# Altium schematic sheet Elreg_Sender_Power.SchDoc
size A; SheetNumber: 3
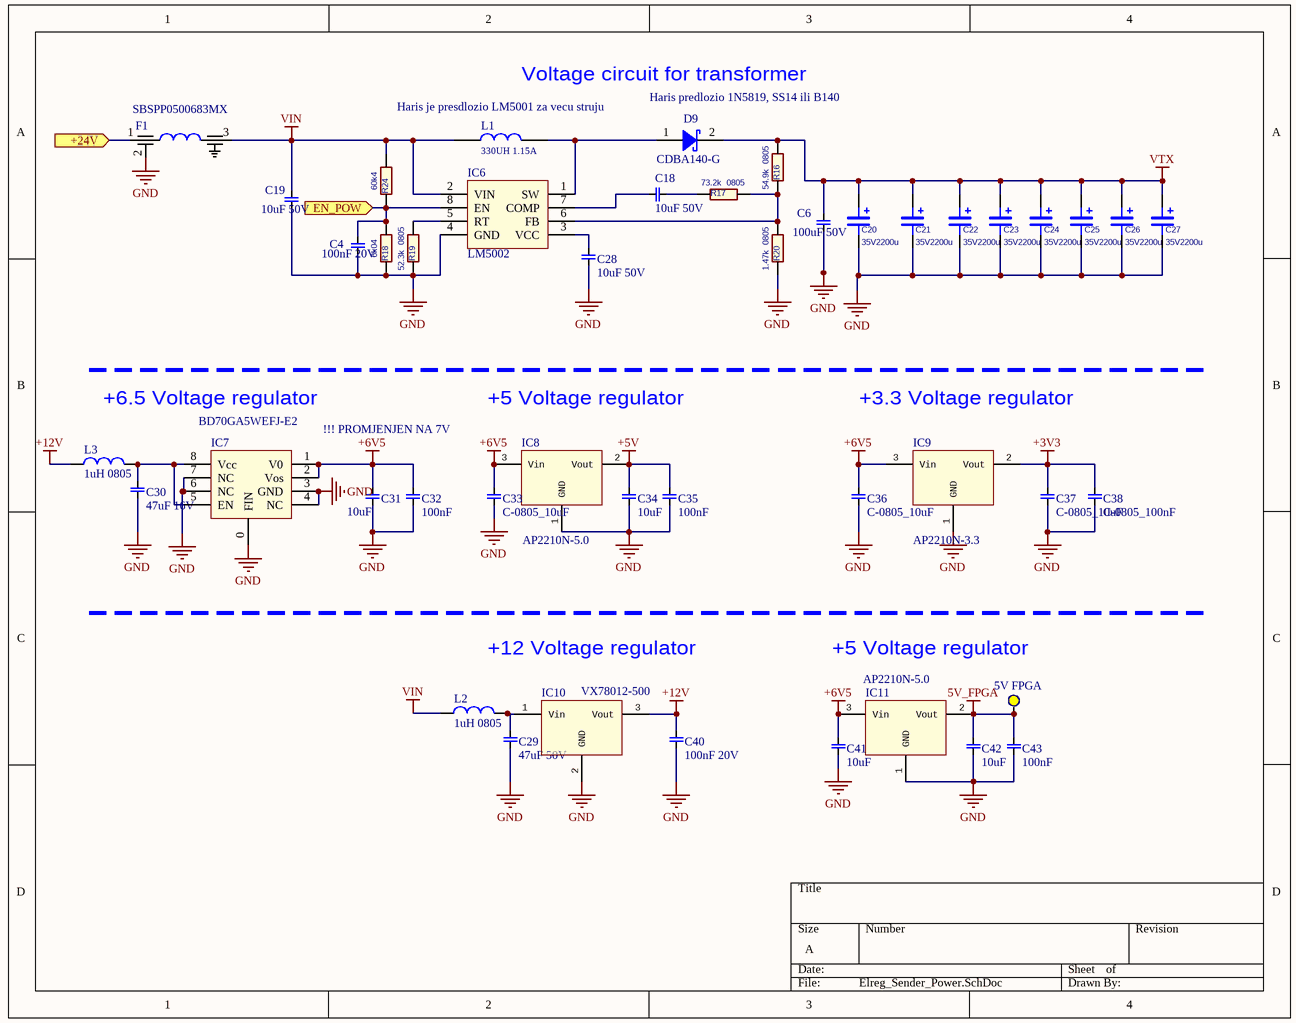
[diagram p0: Elreg_Sender_Power.SchDoc]

## Parts
C4  100nF 20V  [C-0603]
C6  100uF 50V  [C-0805]
C18  10uF 50V  [C-0603]
C19  10uF 50V  [C-0805]
C20  35V2200u  [CAP_16X25]
C21  35V2200u  [CAP_16X25]
C22  35V2200u  [CAP_16X25]
C23  35V2200u  [CAP_16X25]
C24  35V2200u  [CAP_16X25]
C25  35V2200u  [CAP_16X25]
C26  35V2200u  [CAP_16X25]
C27  35V2200u  [CAP_16X25]
C28  10uF 50V  [C-0603]
C29  47uF 50V  [C-0603]
C30  47uF 16V  [C-0603]
C31  10uF  [C-0603]
C32  100nF  [C-0603]
C33  C-0805_10uF  [C-0603]
C34  10uF  [C-0603]
C35  100nF  [C-0603]
C36  C-0805_10uF  [C-0805]
C37  C-0805_10uF  [C-0805]
C38  C-0805_100nF  [C-0805]
C40  100nF 20V  [C-0805]
C41  10uF  [C-0603]
C42  10uF  [C-0603]
C43  100nF  [C-0603]
D9  Manufacturer Part Number 1: CDBA140-G  [DFN380P520X45-2N]  (hidden comment: DIODE SCHOTTKY 40V 1A DO214AC)
F1  SBSPP0500683MX  [Filter_SBSPP0500]
IC6  LM5002  [SOIC127P600X205-8N]
IC7  BD70GA5WEFJ-E2  [HTSOP-J8]  (value not drawn)
IC8  AP2210N-5.0  [SOT23-3]
IC9  AP2210N-3.3  [SOT23-3]
IC10  VX78012-500  [VREG]
IC11  AP2210N-5.0  [SOT23-3]
L1  330UH 1.15A  [IND]
L2  1uH 0805  [0805]
L3  1uH 0805  [0805]
R16  54.9k  0805  [R-0603]
R17  73.2k  0805  [R-0603]
R18  6k04  [R-0603]
R19  52.3k  0805  [R-0603]
R20  1.47k  0805  [R-0603]
R24  60k4  [R-0603]
TP5  5V FPGA  [Test_Point]

## Ports
+24V (in), EN_POW (in)

## Nets
5V_FPGA: C42.1(G) C43.2(G) IC11.2(Vout) TP5.1
+3V3: C37.1(G) C38.2(G) IC9.2(Vout)
+5V: C34.1(G) C35.2(G) IC8.2(Vout)
+6V5: C31.1(G) C32.2(G) C33.1(G) C36.1(G) C41.1(G) IC7.1(V0) IC7.2(Vos) IC8.3(Vin) IC9.3(Vin) IC11.3(Vin)
+12V: C40.2(G) IC10.3(Vout) L3.1(A)
GND: C4.1(G) C6.2(G) C19.2(G) C20.2 C21.2 C22.2 C23.2 C24.2 C25.2 C26.2 C27.2 C28.2(G) C29.2(G) C30.1(G) C31.2(G) C32.1(G) C33.2(G) C34.2(G) C35.1(G) C36.2(G) C37.2(G) C38.1(G) C40.1(G) C41.2(G) C42.2(G) C43.1(G) F1.2 IC6.4(GND) IC7.0(FIN) IC7.3(GND) IC7.4(NC) IC7.6(NC) IC7.7(NC) IC8.1(GND) IC9.1(GND) IC10.2(GND) IC11.1(GND) R18.1 R19.1 R20.1
VIN: C19.1(G) F1.3 IC6.2(VIN) L1.1(A) L2.1(A) R24.2
VTX: C6.1(G) C20.1 C21.1 C22.1 C23.1 C24.1 C25.1 C26.1 C27.1 D9.2(A) R16.2
+24V: F1.1 ; port +24V
EN_POW: C4.2(G) IC6.8(EN) R18.2 R24.1 ; port EN_POW
NetC18_1: C18.1(G) IC6.7(COMP)
NetC18_2: C18.2(G) R17.1
NetC28_1: C28.1(G) IC6.3(VCC)
NetC29_1: C29.1(G) IC10.1(Vin) L2.2(A)
NetC30_2: C30.2(G) IC7.5(EN) IC7.8(Vcc) L3.2(A)
NetD9_1: D9.1(A) IC6.1(SW) L1.2(A)
NetIC6_5: IC6.5(RT) R19.2
NetIC6_6: IC6.6(FB) R16.1 R17.2 R20.2

## Notes on the sheet
- Voltage circuit for transformer
- Haris predlozio 1N5819, SS14 ili B140
- (near L1) Haris je presdlozio LM5001 za vecu struju
- +6.5 Voltage regulator
- (near IC7) BD70GA5WEFJ-E2
- !!! PROMJENJEN NA 7V
- +5 Voltage regulator
- +3.3 Voltage regulator
- +12 Voltage regulator

## Library data of the parts
C4 C32 C35 C38 C40 C43 = C-0805_100nF: Manufacturer 1: Yageo; Manufacturer Part Number 1: CC1206KKX7RBBB332; Tolerance: ±10%; Voltage - Rated: 500V; Temperature Coefficient: X7R; Notification: Current market demand for these product types have resulted in fluctuating and extending lead times. Lead times may differ.; Description 1: CAP CER 3300PF 500V X7R 1206; Category 1: Capacitors; Packaging: Cut Tape (CT); Part Status: Active; Operating Temperature: -55°C ~ 125°C; Features: -; Ratings: -; Applications: General Purpose; Failure Rate: -; Mounting Type: Surface Mount, MLCC; Package / Case: 1206 (3216 Metric); Size / Dimension: 0.126" L x 0.063" W (3.20mm x 1.60mm); Height - Seated (Max): -; Thickness (Max): 0.057" (1.45mm); Lead Spacing: -; Lead Style: -; ComponentLink1URL: http://www.yageo.com/documents/recent/UPY-NP0X7R_MV_100-to-630V_21.pdf; ComponentLink1Description: http://www.yageo.com/documents/recent/UPY-NP0X7R_MV_100-to-630V_21.pdf; Supplier 1: Digi-Key; Supplier Part Number 1: 311-1506-1-ND; RoHS 1: RoHS Compliant; Stock 1: 4928; Pricing 1: 1=0.31, 10=0.214, 100=0.1085, 500=0.07424, 1000=0.06568 (USD)
C6 C18 C19 C28 C29 C31 C33 C34 C36 C37 C41 C42 = C-0805_10uF: Manufacturer 1: Yageo; Manufacturer Part Number 1: CC1206KKX7RBBB332; Tolerance: ±10%; Voltage - Rated: 500V; Temperature Coefficient: X7R; Notification: Current market demand for these product types have resulted in fluctuating and extending lead times. Lead times may differ.; Description 1: CAP CER 3300PF 500V X7R 1206; Category 1: Capacitors; Packaging: Cut Tape (CT); Part Status: Active; Operating Temperature: -55°C ~ 125°C; Features: -; Ratings: -; Applications: General Purpose; Failure Rate: -; Mounting Type: Surface Mount, MLCC; Package / Case: 1206 (3216 Metric); Size / Dimension: 0.126" L x 0.063" W (3.20mm x 1.60mm); Height - Seated (Max): -; Thickness (Max): 0.057" (1.45mm); Lead Spacing: -; Lead Style: -; ComponentLink1URL: http://www.yageo.com/documents/recent/UPY-NP0X7R_MV_100-to-630V_21.pdf; ComponentLink1Description: http://www.yageo.com/documents/recent/UPY-NP0X7R_MV_100-to-630V_21.pdf; Supplier 1: Digi-Key; Supplier Part Number 1: 311-1506-1-ND; RoHS 1: RoHS Compliant; Stock 1: 4928; Pricing 1: 1=0.31, 10=0.214, 100=0.1085, 500=0.07424, 1000=0.06568 (USD)
C20-C27 = CAP_2200uF_35V: Capacitor; Manufacturer: Kemet; Manufacturer Part Number: ESH228M035AM7AA; Capacitance: 2200µF; Tolerance: ±20%; Voltage Rating: 35V; Lifetime @ Temp.: 2000 Hrs @ 105°C; Supplier 1: Digi-Key; Supplier Part Number 1: 399-6572-ND; RoHS: RoHS Compliant; Category: Capacitors; Stock 1: 1972; Pricing 1: 1=0.98, 10=0.77, 50=0.6676, 100=0.5778, 250=0.5136, 500=0.43656, 1000=0.3852, 2500=0.35952, 5000=0.34668 (USD); Packaging: Bulk; ESR (Equivalent Series Resistance): -; Operating Temperature: -40°C ~ 105°C; Type: -; Applications: General Purpose; Ripple Current: -; Impedance: -; Lead Spacing: 0.295" (7.50mm); Size / Dimension: 0.630" Dia (16.00mm); Height - Seated (Max): 1.063" (27.00mm); Surface Mount Land Size: -; Mounting Type: Through Hole; Package / Case: Radial, Can; ComponentLink1URL: http://www.kemet.com/docfinder?Partnumber=ESH228M035AM7AA; ComponentLink1Description: http://www.kemet.com/docfinder?Partnumber=ESH228M035AM7AA
C30 = C-0805_3_3uF: Manufacturer 1: Yageo; Manufacturer Part Number 1: CC1206KKX7RBBB332; Tolerance: ±10%; Voltage - Rated: 500V; Temperature Coefficient: X7R; Notification: Current market demand for these product types have resulted in fluctuating and extending lead times. Lead times may differ.; Description 1: CAP CER 3300PF 500V X7R 1206; Category 1: Capacitors; Packaging: Cut Tape (CT); Part Status: Active; Operating Temperature: -55°C ~ 125°C; Features: -; Ratings: -; Applications: General Purpose; Failure Rate: -; Mounting Type: Surface Mount, MLCC; Package / Case: 1206 (3216 Metric); Size / Dimension: 0.126" L x 0.063" W (3.20mm x 1.60mm); Height - Seated (Max): -; Thickness (Max): 0.057" (1.45mm); Lead Spacing: -; Lead Style: -; ComponentLink1URL: http://www.yageo.com/documents/recent/UPY-NP0X7R_MV_100-to-630V_21.pdf; ComponentLink1Description: http://www.yageo.com/documents/recent/UPY-NP0X7R_MV_100-to-630V_21.pdf; Supplier 1: Digi-Key; Supplier Part Number 1: 311-1506-1-ND; RoHS 1: RoHS Compliant; Stock 1: 4928; Pricing 1: 1=0.31, 10=0.214, 100=0.1085, 500=0.07424, 1000=0.06568 (USD)
D9 = DIODE SCHOTTKY 40V 1A DO214AC: Manufacturer 1: Comchip Technology; Category 1: Discrete Semiconductor Products; Speed: Fast Recovery =< 500ns, > 200mA (Io); Supplier 1: Digi-Key; Supplier Part Number 1: 641-1015-1-ND; RoHS 1: RoHS Compliant; Description 1: DIODE SCHOTTKY 40V 1A DO214AC; Stock 1: 527910; Pricing 1: 1=0.37, 10=0.338, 100=0.1893, 500=0.1014, 1000=0.06895 (USD); Packaging: Cut Tape (CT); Part Status: Active; Diode Type: Schottky; Current - Average Rectified (Io): 1A; Capacitance @ Vr, F: -; Mounting Type: Surface Mount; Package / Case: DO-214AC, SMA; Supplier Device Package: DO-214AC (SMA); Operating Temperature - Junction: -65°C ~ 125°C; Base Part Number: CDBA140; ComponentLink1URL: http://www.comchiptech.com/admin/files/product/CDBA140-HF%20Thru192841.%20CDBA1100-HF%20RevB.pdf; ComponentLink1Description: http://www.comchiptech.com/admin/files/product/CDBA140-HF%20Thru192841.%20CDBA1100-HF%20RevB.pdf
F1 = Filter_SBSPP0500683MX
IC6 = LM5002: Manufacturer 1: Texas Instruments; Manufacturer Part Number 1: LM5002SD/NOPB; Description 1: IC REG MULT CONFIG ISO ADJ 8WSON; Category 1: Integrated Circuits (ICs); Function: Step-Up, Step-Up/Step-Down; Output Configuration: Positive, Isolation Capable; Topology: Boost, Flyback, Forward Converter, SEPIC; Output Type: Adjustable; Number of Outputs: 1; Voltage - Input (Min): 3.1V; Voltage - Input (Max): 75V; Voltage - Output (Max): 76V (Switch); Current - Output: 400mA (Switch); Frequency - Switching: 50kHz ~ 1.5MHz; Synchronous Rectifier: No; Supplier 1: Digi-Key; Supplier Part Number 1: LM5002SD/NOPBTR-ND; RoHS 1: RoHS Compliant; Stock 1: 3000; Pricing 1: 1000=1.9656, 2000=1.86732, 5000=1.79712 (USD); Packaging: Tape & Reel (TR); Part Status: Active; Voltage - Output (Min/Fixed): 3.1V; Operating Temperature: -40°C ~ 125°C (TJ); Mounting Type: Surface Mount; Package / Case: 8-WDFN Exposed Pad; Supplier Device Package: 8-WSON (4x4); ComponentLink1URL: http://www.ti.com/lit/ds/symlink/lm5002.pdf; ComponentLink1Description: http://www.ti.com/lit/ds/symlink/lm5002.pdf; Base Part Number: LM5002
IC7 = BD70GA5WEFJ-E2: Manufacturer 1: Texas Instruments; Manufacturer Part Number 1: LM5002SD/NOPB; Description 1: IC REG MULT CONFIG ISO ADJ 8WSON; Category 1: Integrated Circuits (ICs); Function: Step-Up, Step-Up/Step-Down; Output Configuration: Positive, Isolation Capable; Topology: Boost, Flyback, Forward Converter, SEPIC; Output Type: Adjustable; Number of Outputs: 1; Voltage - Input (Min): 3.1V; Voltage - Input (Max): 75V; Voltage - Output (Max): 76V (Switch); Current - Output: 400mA (Switch); Frequency - Switching: 50kHz ~ 1.5MHz; Synchronous Rectifier: No; Supplier 1: Digi-Key; Supplier Part Number 1: LM5002SD/NOPBTR-ND; RoHS 1: RoHS Compliant; Stock 1: 3000; Pricing 1: 1000=1.9656, 2000=1.86732, 5000=1.79712 (USD); Packaging: Tape & Reel (TR); Part Status: Active; Voltage - Output (Min/Fixed): 3.1V; Operating Temperature: -40°C ~ 125°C (TJ); Mounting Type: Surface Mount; Package / Case: 8-WDFN Exposed Pad; Supplier Device Package: 8-WSON (4x4); ComponentLink1URL: http://www.ti.com/lit/ds/symlink/lm5002.pdf; ComponentLink1Description: http://www.ti.com/lit/ds/symlink/lm5002.pdf
IC8 IC11 = AP2210N-5: AP2210N-5.0TRG1DICT-ND
IC9 = AP2210N-3.3: AP2210N-3.3TRG1DICT-ND
L1 = FIXED IND 330UH 1.15A 580 MOHM: Manufacturer 1: BOURNS; Manufacturer Part Number 1: SRR1260-331K; Description 1: BOURNS - SRR1260-331K - INDUCTOR, SHIELDED, 330UH, 1.1A, SMD; Inductance: 330; RMS Current (Irms): 1.15; Inductor Construction: Shielded; Saturation Current (Isat): 1.1; Product Range: SRR1260 Series; Power Inductor Case: 12.5mm x 12.5mm x 6; Q Factor: 22; Supplier 1: Farnell; Supplier Part Number 1: 2458509; RoHS 1: YES; Stock 1: 143; Pricing 1: 1=0.843, 10=0.721, 25=0.661, 50=0.6, 100=0.552 (GBP); ComponentLink1URL: http://www.farnell.com/datasheets/2251090.pdf; ComponentLink1Description: http://www.farnell.com/datasheets/2251090.pdf
L2 L3 = induktor_0806: Manufacturer 1: BOURNS; Manufacturer Part Number 1: SRR1260-331K; Description 1: BOURNS - SRR1260-331K - INDUCTOR, SHIELDED, 330UH, 1.1A, SMD; Inductance: 330; RMS Current (Irms): 1.15; Inductor Construction: Shielded; Saturation Current (Isat): 1.1; Product Range: SRR1260 Series; Power Inductor Case: 12.5mm x 12.5mm x 6; Q Factor: 22; Supplier 1: Farnell; Supplier Part Number 1: 2458509; RoHS 1: YES; Stock 1: 143; Pricing 1: 1=0.843, 10=0.721, 25=0.661, 50=0.6, 100=0.552 (GBP); ComponentLink1URL: http://www.farnell.com/datasheets/2251090.pdf; ComponentLink1Description: http://www.farnell.com/datasheets/2251090.pdf
R16 R17 R19 R20 = CRCW0805xxxxJN Default: RES xx OHM 1/8W 5% 0805 SMD; Category 1: Resistors
R18 R24 = CRCW08051K00FKEA: RES 1 KOHM 1/8W 1% 0805 SMD; Manufacturer 1: Vishay Dale; Description 1: RES SMD 1K OHM 1% 1/8W 0805; Category 1: Resistors; Resistance (Ohms): 1k; Power (Watts): 0.125W, 1/8W; Temperature Coefficient: ±100ppm/°C; Description 2: Thick Film Resistors - SMD 1/8watt 1Kohms 1% 100ppm; Category 2: Thick Film Resistors - SMD; Power Rating: 125 mW (1/8 W); Resistance: 1 kOhms; Voltage Rating: 150 V; Brand: Vishay / Dale; Supplier 1: Digi-Key; Supplier Part Number 1: 541-1.00KCCT-ND; Manufacturer Part Number 1: CRCW08051K00FKEA; RoHS 1: RoHS Compliant; Packaging: Cut Tape (CT); Tolerance: ±1%; Composition: Thick Film; Features: Automotive AEC-Q200; Operating Temperature: -55°C ~ 155°C; Package / Case: 0805 (2012 Metric); Supplier Device Package: 0805 (2012 Metric); Size / Dimension: 0.079" L x 0.049" W (2.00mm x 1.25mm); Height: 0.020" (0.50mm); ComponentLink1URL: http://www.vishay.com/docs/20035/dcrcwe3.pdf; ComponentLink1Description: http://www.vishay.com/docs/20035/dcrcwe3.pdf; Supplier 2: Mouser; Supplier Part Number 2: 71-CRCW0805-1.0K-E3; Manufacturer 2: Vishay; Manufacturer Part Number 2: CRCW08051K00FKEA; RoHS 2: RoHS Compliant By Exemption; Length: 2 mm; Operating Temperature Range: - 55 C to + 155 C; Package/Case: 0805 (2012 metric); Product: Thick Film Resistors SMD; Series: CRCW; Termination Style: SMD/SMT; Width: 1.25 mm; Case Code - in: 0805; Case Code - mm: 2012; Product Category: 0805 Thick Film Chip Resistors; Standard Pack Qty: 5000; RoHS - Mouser: E; Minimum Order Quantity: 1; Reeling: True; ComponentLink2URL: http://www.mouser.com/ds/2/427/dcrcwe3-109170.pdf; ComponentLink2Description: http://www.mouser.com/ds/2/427/dcrcwe3-109170.pdf
TP5 = Test_Point